# Altium schematic sheet Inverter.SchDoc (part 1 of 3)
size A2; SheetNumber: 2; SheetTotal: 5
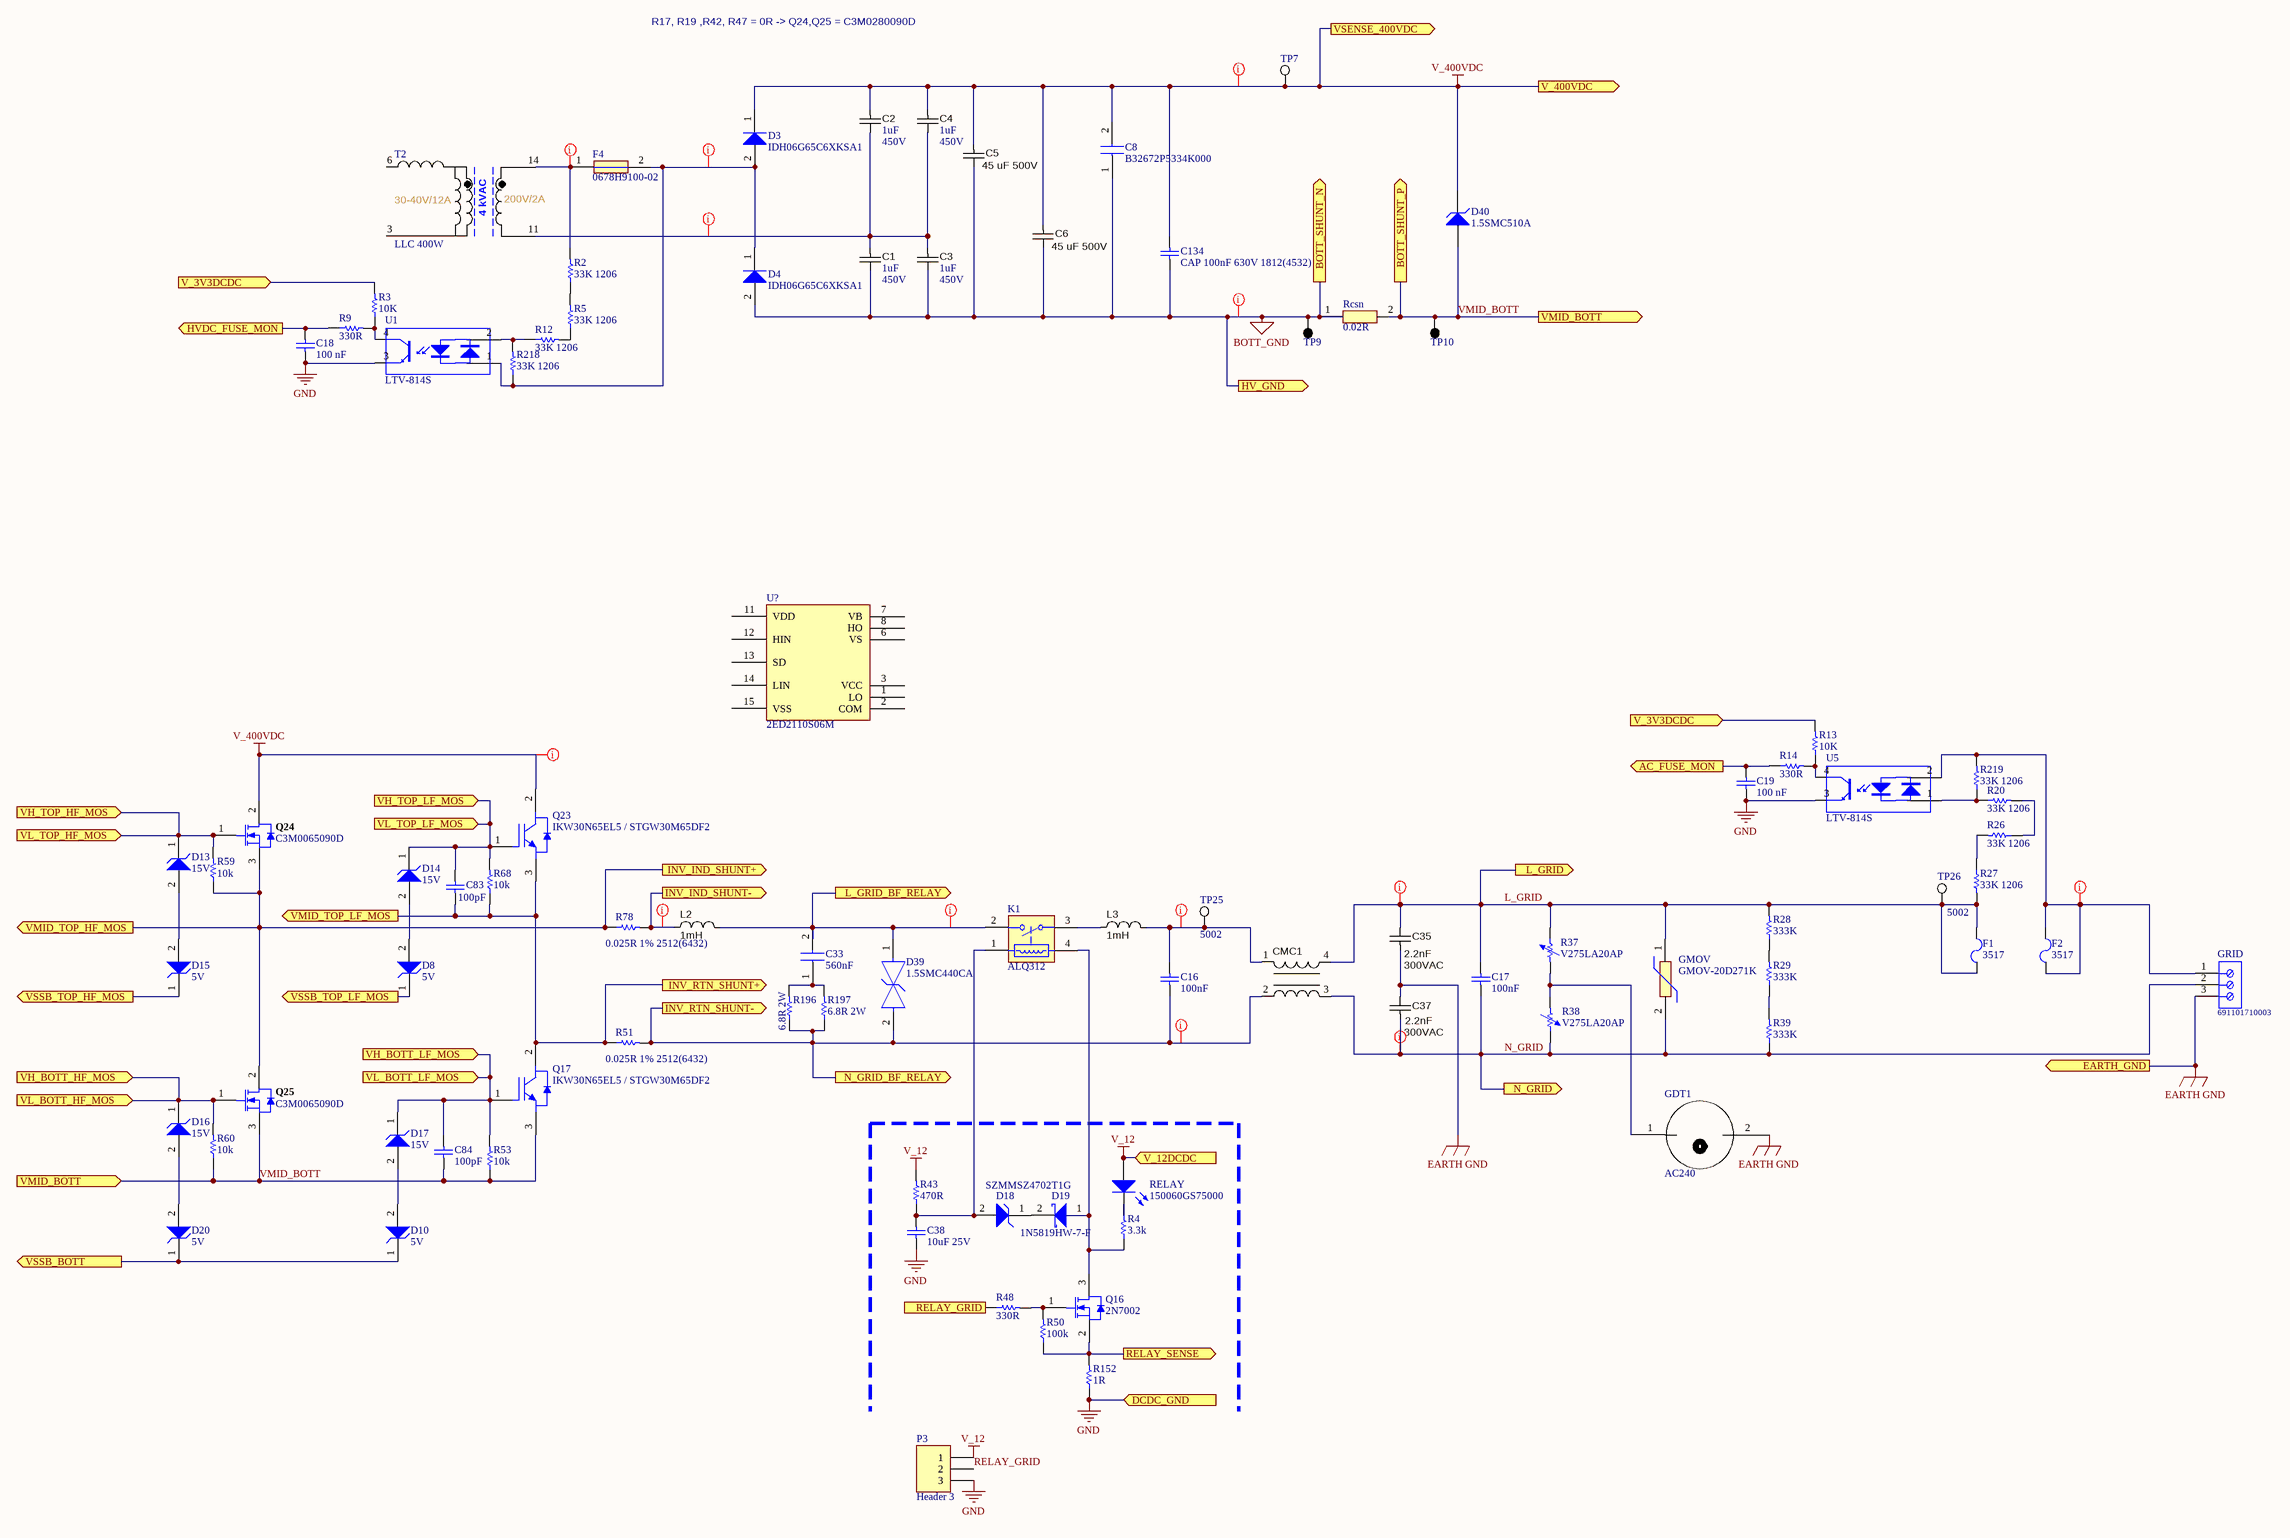
[diagram p0: Inverter.SchDoc]

## Parts
C1  Voltage Rating (DC): 450V  [ECW-FE2W105K]  (hidden comment: 1uF)
C2  Voltage Rating (DC): 450V  [ECW-FE2W105K]  (hidden comment: 1uF)
C3  Voltage Rating (DC): 450V  [ECW-FE2W105K]  (hidden comment: 1uF)
C4  Voltage Rating (DC): 450V  [ECW-FE2W105K]  (hidden comment: 1uF)
C5  45 uF 500V  [C4AQLLW5450A38K]
C6  45 uF 500V  [C4AQLLW5450A38K]
C8  B32672P5334K000  [B32672P5334K000]
C16  100nF  [TDK-B32922C3104K]
C17  100nF  [TDK-B32922C3104K]
C18  100 nF  [CAPC1608X90X40NL10T20]
C19  100 nF  [CAPC1608X90X40NL10T20]
C33  560nF  [R463I347040N0M]
C35  Ratings: 300VAC  [CAPMF13.0x5.0x11.0x10.0mm LxWxHxP]  (hidden comment: 2.2nF)
C37  Ratings: 300VAC  [CAPMF13.0x5.0x11.0x10.0mm LxWxHxP]  (hidden comment: 2.2nF)
C38  10uF 25V  [CAPC3216X229X50NL20T25]
C83  100pF  [CAPC1608X90X40NL10T20]
C84  100pF  [CAPC1608X90X40NL10T20]
C134  CAP 100nF 630V 1812(4532)  [CAPC1812(4532)230_L]
CMC1  (no value)  [DTS-20/0,47/7,0]
D3  IDH06G65C6XKSA1  [INF-PG-TO220-2-1]
D4  IDH06G65C6XKSA1  [INF-PG-TO220-2-1]
D8  5V  [ONSC-SOD-523-2-502-01_V]
D10  5V  [ONSC-SOD-523-2-502-01_V]
D13  15V  [ONSC-SOD-523-2-502-01_V]
D14  15V  [ONSC-SOD-523-2-502-01_V]
D15  5V  [ONSC-SOD-523-2-502-01_V]
D16  15V  [ONSC-SOD-523-2-502-01_V]
D17  15V  [ONSC-SOD-523-2-502-01_V]
D18  SZMMSZ4702T1G  [ONSC-SOD-123-2-425-04_V]
D19  1N5819HW-7-F  [DIOD-SOD-123-2_V]
D20  5V  [ONSC-SOD-523-2-502-01_V]
D39  1.5SMC440CA  [FP-1_5SMC-MFG]
D40  1.5SMC510A  [FAIR-DO-214AB-2_V]
F1  3517  [KSTN-3517-2_V]
F2  3517  [KSTN-3517-2_V]
F4  0678H9100-02  [FUSC9830X318N]
GDT1  AC240  [AC240]
GMOV  GMOV-20D271K  [GMOV20D271K]
GRID  691101710003  [691101710003]
K1  ALQ312  [PNSC-LQ-4-2000x1000x1600_V]
L2  1mH  [PCBComponent_1]
L3  1mH  [PCBComponent_1]
P3  Header 3  [HDR1X3]
Q16  2N7002  [STM-SOT-23-3_V]
Q17  IKW30N65EL5 / STGW30M65DF2  [INF-PG-TO247-3_V]
Q23  IKW30N65EL5 / STGW30M65DF2  [INF-PG-TO247-3_V]
Q24  C3M0065090D  [CREE-TO-247-3_V]
Q25  C3M0065090D  [CREE-TO-247-3_V]
R2  33K 1206  [RESC3216X70X50NL05T20]
R3  10K  [RESC1609X50X30NL8T20]
R4  3.3k  [RESC1608X55X25NL10T15]
R5  33K 1206  [RESC3216X70X50NL05T20]
R9  330R  [RESC1608X55X25NL10T15]
R12  33K 1206  [RESC3216X70X50NL05T20]
R13  10K  [RESC1609X50X30NL8T20]
R14  330R  [RESC1608X55X25NL10T15]
R20  33K 1206  [RESC3216X70X50NL05T20]
R26  33K 1206  [RESC3216X70X50NL05T20]
R27  33K 1206  [RESC3216X70X50NL05T20]
R28  333K  [RESC3216X70X50NL05T20]
R29  333K  [RESC3216X70X50NL05T20]
R37  V275LA20AP  [LFUS-V275LA20AP]
R38  V275LA20AP  [LFUS-V275LA20AP]
R39  333K  [RESC3216X70X50NL05T20]
R43  470R  [RESC3216X70X50NL05T20]
R48  330R  [RESC1608X55X30NL15T15]
R50  100k  [RESC1608X55X30NL15T15]
R51  0.025R 1% 2512(6432)  [RESC2512(6432)_N]
R53  10k  [RESC1608X55X30ML15T15]
R59  10k  [RESC1608X55X30ML15T15]
R60  10k  [RESC1608X55X30ML15T15]
R68  10k  [RESC1608X55X30ML15T15]
R78  0.025R 1% 2512(6432)  [RESC2512(6432)_N]
R152  1R  [RESC1608X55X30NL15T15]
R196  6.8R 2W  [RESC2512(6432)_L]
R197  6.8R 2W  [RESC2512(6432)_L]
R218  33K 1206  [RESC3216X70X50NL05T20]
R219  33K 1206  [RESC3216X70X50NL05T20]
Rcsn  0.02R  [RESC1632X80N]
RELAY  150060GS75000  [0603_A]
T2  LLC 400W  [ETD39-K-V-16P-HORIZONTAL-SEC]
TP7  5002  [KSTN-5002]  (value not drawn)
TP9  5001  [KSTN-5001]  (value not drawn)
TP10  5001  [KSTN-5001]  (value not drawn)
TP25  5002  [KSTN-5002]
TP26  5002  [KSTN-5002]
U1  LTV-814S  [LTV-814S]
U5  LTV-814S  [LTV-814S]
U?  2ED2110S06M  [RW-16_N]

## Ports
AC_FUSE_MON (out), BOTT_SHUNT_N (out), BOTT_SHUNT_P (out), DCDC_GND (in), EARTH_GND (out), HV_GND (out), HVDC_FUSE_MON (out), INV_IND_SHUNT+ (out), INV_IND_SHUNT- (out), INV_RTN_SHUNT+ (out), INV_RTN_SHUNT- (out), L_GRID (out), L_GRID_BF_RELAY (out), N_GRID (out), N_GRID_BF_RELAY (out), RELAY_GRID (in), RELAY_SENSE (out), V_3V3DCDC (in), V_12DCDC (in), V_400VDC (out), VH_BOTT_HF_MOS (in), VH_BOTT_LF_MOS (in), VH_TOP_HF_MOS (in), VH_TOP_LF_MOS (in), VL_BOTT_HF_MOS (in), VL_BOTT_LF_MOS (in), VL_TOP_HF_MOS (in), VL_TOP_LF_MOS (in), VMID_BOTT (in), VMID_BOTT (out), VMID_TOP_HF_MOS (out), VMID_TOP_LF_MOS (out), VSENSE_400VDC (out), VSSB_BOTT (out), VSSB_TOP_HF_MOS (out), VSSB_TOP_LF_MOS (out)

## Nets
BOTT_GND: C1.2 C3.2 C5.2 C6.2 C8.1 C134.1 D4.2(A) Rcsn.1 TP9.1 ; port BOTT_SHUNT_N, port HV_GND
EARTH GND: C35.1 C37.2 GDT1.2 GRID.3 ; port EARTH_GND
GND: C18.1 C19.1 C38.1 P3.3 R152.1 U1.3(EMITTER) U5.3(EMITTER) ; port DCDC_GND
V_12: P3.1 R43.2 RELAY.2(A) ; port V_12DCDC
V_400VDC: C2.1 C4.1 C5.1 C6.1 C8.2 C134.2 D3.1(K) D40.2(K) Q23.2(C) Q24.2(D) TP7.1 ; port V_400VDC, port VSENSE_400VDC
AC_FUSE_MON: C19.2 R14.1 ; port AC_FUSE_MON
HVDC_FUSE_MON: C18.2 R9.1 ; port HVDC_FUSE_MON
INV_IND_SHUNT+: Q24.3(S) Q25.2(D) R59.1 R78.1 ; port VMID_TOP_HF_MOS, port INV_IND_SHUNT+
INV_IND_SHUNT-: L2.2 R78.2 ; port INV_IND_SHUNT-
INV_RTN_SHUNT+: C83.1 Q17.2(C) Q23.3(E) R51.1 R68.1 ; port VMID_TOP_LF_MOS, port INV_RTN_SHUNT+
INV_RTN_SHUNT-: C16.1 CMC1.2 D39.2 R51.2 R196.1 R197.1 ; port INV_RTN_SHUNT-, port N_GRID_BF_RELAY
L_GRID: C17.2 C35.2 CMC1.4 F1.1 F1.2 GMOV.1 R27.2 R28.2 R37.2 TP26.1 ; port L_GRID
L_GRID_BF_RELAY: C33.2 D39.1 K1.2(NO) L2.1 ; port L_GRID_BF_RELAY
N_GRID: C17.1 C37.1 CMC1.3 GMOV.2 GRID.2 R38.2 R39.1 ; port N_GRID
RELAY_GRID: R48.1 ; port RELAY_GRID
RELAY_GRID: P3.2  [a separate net that carries the same name]
RELAY_SENSE: Q16.2(S) R50.1 R152.2 ; port RELAY_SENSE
V_3V3DCDC: R3.2 R13.2 ; port V_3V3DCDC
VH_BOTT_HF_MOS: D16.1(K) Q25.1(G) R60.2 ; port VH_BOTT_HF_MOS, port VL_BOTT_HF_MOS
VH_BOTT_LF_MOS: C84.2 D17.1(K) Q17.1(G) R53.2 ; port VH_BOTT_LF_MOS, port VL_BOTT_LF_MOS
VH_TOP_HF_MOS: D13.1(K) Q24.1(G) R59.2 ; port VH_TOP_HF_MOS, port VL_TOP_HF_MOS
VH_TOP_LF_MOS: C83.2 D14.1(K) Q23.1(G) R68.2 ; port VH_TOP_LF_MOS, port VL_TOP_LF_MOS
VMID_BOTT: C84.1 D40.1(A) Q17.3(E) Q25.3(S) R53.1 R60.1 Rcsn.2 TP10.1 ; port VMID_BOTT, port BOTT_SHUNT_P
VSSB_BOTT: D10.1(K) D20.1(K) ; port VSSB_BOTT
VSSB_TOP_HF_MOS: D15.1(K) ; port VSSB_TOP_HF_MOS
VSSB_TOP_LF_MOS: D8.1(K) ; port VSSB_TOP_LF_MOS
NetC1_1: C1.1 C2.2 C3.1 C4.2 T2.11
NetC16_2: C16.2 CMC1.1 L3.1 TP25.1
NetC33_1: C33.1 R196.2 R197.2
NetC38_2: C38.2 D18.2(A) K1.1 R43.1
NetD3_2: D3.2(A) D4.1(K) F4.2 R218.1 U1.1(ANODE)
NetD8_2: D8.2(A) D14.2(A)
NetD10_2: D10.2(A) D17.2(A)
NetD13_2: D13.2(A) D15.2(A)
NetD16_2: D16.2(A) D20.2(A)
NetD18_1: D18.1(K) D19.2(K)
NetD19_1: D19.1(A) K1.4 Q16.3(D) R4.1
NetF2_1: F2.1 F2.2 GRID.1 R219.2 U5.2(CATHODE)
NetF4_1: F4.1 R2.2 T2.14
NetGDT1_1: GDT1.1 R37.1 R38.1
NetK1_3: K1.3(COM) L3.2
NetQ16_1: Q16.1(G) R48.2 R50.2
NetR2_1: R2.1 R5.2
NetR3_1: R3.1 R9.2 U1.4(COLLECTOR)
NetR4_2: R4.2 RELAY.1(K)
NetR5_1: R5.1 R12.2
NetR12_1: R12.1 R218.2 U1.2(CATHODE)
NetR13_1: R13.1 R14.2 U5.4(COLLECTOR)
NetR20_1: R20.1 R219.1 U5.1(ANODE)
NetR20_2: R20.2 R26.1
NetR26_2: R26.2 R27.1
NetR28_1: R28.1 R29.2
NetR29_1: R29.1 R39.2

Not connected (* = marked no-connect by the designer): T2 3 6; U? 1(LO) 2(COM) 3(VCC) 6(VS) 7(VB) 8(HO) 11(VDD) 12(HIN) 13(SD) 14(LIN) 15(VSS)

## Layout directives
net class HVDC+: INV_IND_SHUNT-, NetD3_2, NetF4_1, V_400VDC
net class GRID+: L_GRID, L_GRID_BF_RELAY, NetF2_1
net class GRID-: INV_RTN_SHUNT-, N_GRID, NetC16_2
net class HVDC-: BOTT_GND, NetC1_1

## Notes on the sheet
- R17, R19 ,R42, R47 = 0R -> Q24,Q25 = C3M0280090D
- (in symbol TI-ETD39-200V-2A-LLC) 30-40V/12A; 200V/2A; 4 kVAC